# EAGLE design Fume Extractor (EAGLE 6.4)
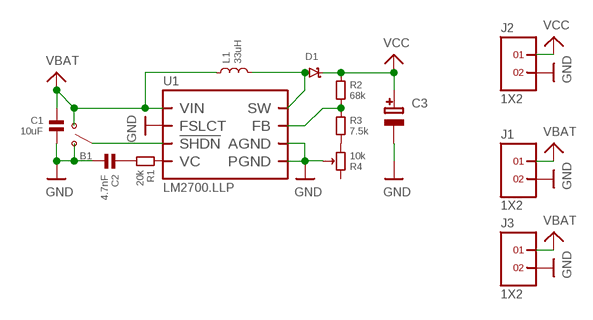
[diagram p0: schematic, sheet 1]

## Parts
B1  SSSS810701  [SSSS810701]
C1  10uF  CAPACITOR.0805  [0805]
C2  4.7nF  CAPACITOR.0603  [0603]
C3  CAP_ELECTROLYTICPANASONIC_D  [PANASONIC_D]
D1  DIODE[SCHOTKY]-SOD123W  [SOD123W]
J1  1X2  [1X2]
J2  1X2  [1X2]
J3  1X2  [1X2]
L1  33uH  INDUCTOR-SRN6045  [SRN6045]
R1  20k  RESISTOR.0603  [0603]
R2  68k  RESISTOR.0603  [0603]
R3  7.5k  RESISTOR.0603  [0603]
R4  10k  RS08U111Z001  [RS08U111Z001]
U1  LM2700.LLP  [LLP-EP]

## Nets
GND: B1.3(A) C1.2 C2.2 C3.- J1.2 J2.2 J3.2 R4.B U1.4(AGND) U1.5(PGND) U1.6(PGND) U1.7(PGND) U1.13(FSLCT) U1.PAD(PGND)
N$1: R2.2 R3.1 U1.2(FB)
N$2: C2.1 R1.2
N$3: R3.2 R4.C
N$4: D1.P$1 L1.2 U1.8(SW) U1.9(SW) U1.10(SW)
N$5: B1.2(COM) U1.3(!SHDN)
N$7: R1.1 U1.1(VC)
VBAT: B1.1(B) C1.1 J1.1 J3.1 L1.1 U1.12(VIN)
VCC: C3.+ D1.P$2 J2.1 R2.1
Unconnected: R4.A

## Library data of the parts
B1 = alps:SSSS810701
C1 C2 = standardparts:CAPACITOR
C3 = microbuilder:CAP_ELECTROLYTIC: Electrolytic Capacitors SMT PANASONIC_C - Size C Panasonic Electrolytic Aluminum Capacitor 47µF 16V 20% Electrolytic Capacitor [Digikey: PCE3890TR-ND] PANASONIC_D - Size D Panasonic Electrolytic Aluminum Capacitor 100µF 25V 20% Electrolytic Capacitor [Digikey: PCE3898TR-ND] PTH 3.5 mm grid, 8 mm diameter ... 3.5 mm grid, 10 mm diameter ...
D1 = nxp:DIODE[SCHOTKY]
J1-J3 = headers(.1in):1X2
L1 = bourns:INDUCTOR
R1-R3 = standardparts:RESISTOR
R4 = alps:RS08U111Z001
U1 = packages(ti):LM2700

## Board
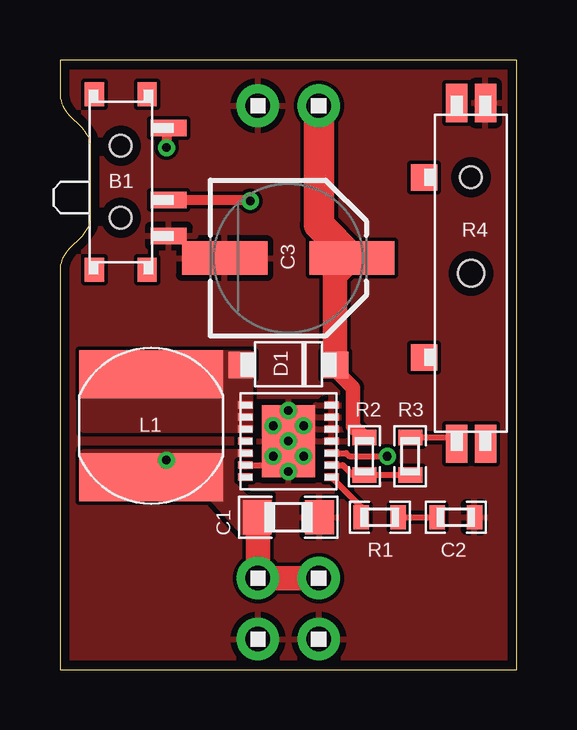
[diagram p1: board, top side]
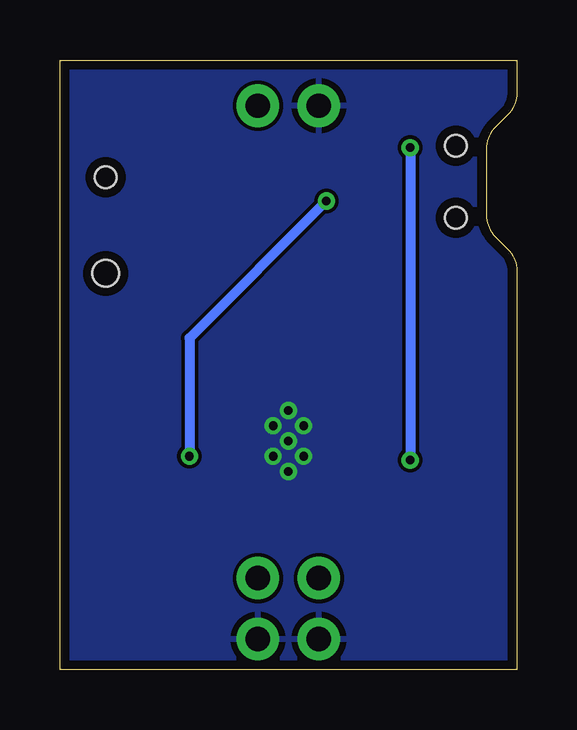
[diagram p2: board, bottom side, seen from below]

Size 19.05 x 25.4 mm. Coordinates in mm from the lower left corner, seen from the top.
Outline: 0,0 19.05,0 19.05,25.4 0,25.4 0,24.02 arc45 0.37,23.12 0.9,22.6 arc-45 1.27,21.7 1.27,18.94 arc-45 0.9,18.04 0.37,17.52 arc45 0,16.62 0,0
Copper layers (1*16): Top 0.0356mm / dielectric 1.5011mm / Bottom 0.0356mm
Design rules "OSHPark": minimum track width 6mil, minimum drill 13mil, track to track 6mil, track to pad 6mil, pad to pad 6mil, via to via 6mil, smd to smd 0mil, copper to edge 15mil, drill to drill 6mil, minimum pad ring 7mil, minimum via ring 7mil, stop-mask expansion 0mil, vias tented up to drill 16mil, thermal gap 10mil

### Footprints (pad centres in the part's own frame; a part is rotated, then mirrored left to right if it is on the bottom)
SSSS810701 = smd 0.7 x 1.5: 1 -2.25,2; 2 0.75,2; 3 2.25,2 | smd 1 x 0.8: 4.1 -3.65,1.1; 4.2 3.65,1.1; 4.3 -3.65,-1.1; 4.4 3.65,-1.1 | hole 0.9: 1.5,0; -1.5,0
0805 = smd 1.2 x 1.4: 1 -1.3,0; 2 1.3,0
0603 = smd 0.65 x 1: 1 -0.775,0; 2 0.775,0
PANASONIC_D = smd 3.556 x 1.4: + 2.654,0; - -2.654,0
SOD123W = smd 1.1 x 1.1: P$1 -1.95,0; P$2 1.95,0
1X2 = drill 1.016 pad 1.778: 1 0,0; 2 2.54,0
SRN6045 = smd 2 x 6: 1 -2.15,0; 2 2.15,0
RS08U111Z001 = smd 1.6 x 0.9: A -7.1,-0.6; B -7.1,0.6; C 7.1,-0.6; NC 7.1,0.6 | smd 1.1 x 1.1: PAD@1 -4,-1.95; PAD@2 3.5,-1.95 | hole 1.1: 0,0 | hole 0.9: -4,0
LLP-EP = smd 0.6 x 0.3: 1 -1.8,1.5; 2 -1.8,1; 3 -1.8,0.5; 4 -1.8,0; 5 -1.8,-0.5; 6 -1.8,-1; 7 -1.8,-1.5; 8 1.8,-1.5; 9 1.8,-1; 10 1.8,-0.5; 11 1.8,0; 12 1.8,0.5; 13 1.8,1; 14 1.8,1.5 | smd 2.2 x 3: PAD 0,0

### Placement (x,y rotation side)
B1  2.54,20.32 270 top
C1  9.53,6.35 0 top
C2  16.51,6.35 0 top
C3  9.53,17.14 0 top
D1  9.53,12.7 0 top
J1  8.26,3.81 270 top
J2  10.79,23.5 180 top
J3  10.79,3.81 270 top
L1  3.81,10.16 90 top
R1  13.34,6.35 0 top
R2  12.7,8.89 270 top
R3  14.61,8.89 90 top
R4  17.14,16.51 270 top
U1  9.53,9.53 180 top

### Tracks (layer width: path | path; a pad name or v marks a point on that pad's centre or on a via)
GND  (via drill 0.36)
  Top 0.254: U1.13 8.53,8.53 U1.PAD
  other vias: 9.53,9.53 9.53,10.79 9.53,8.26 8.89,8.89 8.89,10.16 10.16,10.16 10.16,8.89
  pour Bottom (rank 6): 0,0 19.05,0 19.05,25.4 0,25.4
  pour Top (rank 6): 0,0 19.05,0 19.05,25.4 0,25.4
N$1
  Top 0.254: U1.2 11.79,8.53 12.21,8.12 R2.2 R3.1
N$2
  Top 0.254: R1.2 C2.1
N$3
  Top 0.254: R4.C 16.29,9.66 R3.2
N$4
  pour Top (no thermals): 7.94,13.18 0.95,13.18 0.95,10 7.94,10
N$5  (via drill 0.36)
  Top 0.254: U1.3 11.93,9.03 12.06,8.89 v13.65,8.89
  Top 0.406: B1.2 7.89,19.57 v7.94,19.53
  Bottom 0.406: v7.94,19.53 13.65,13.81 v13.65,8.89
N$7
  Top 0.254: U1.1 12.56,6.79 R1.1
VBAT  (via drill 0.36)
  Top 0.406: B1.1 4.45,22.48 v4.45,21.75
  Top 1.016: C1.1 8.26,6.32 J1.1 J3.1
  Bottom 0.406: v4.45,21.75 v4.45,8.73
  pour Top (no thermals): 7.94,9.05 0.95,9.05 0.95,7.14 6.35,7.14 7.62,5.71 8.73,5.71 8.73,7.14 7.78,7.14 7.3,7.62 7.3,8.89 7.94,8.89
VCC
  Top 0.61: R2.1 12.22,10.14 12.22,11.75 11.47,12.5 D1.P$2
  Top 1.016: D1.P$2 11.47,16.44 C3.+
  Top 1.27: J2.1 10.79,18.53 C3.+

### Text on the board
tDocu: FAN+ | FAN- | VBAT | GND
bDocu: FAN+ | FAN- | Fume / Extractor | Cruz Monrreal II | AnomalousMaker.com | VBAT | GND